# Altium project JDR2812-宇航（公开）.PrjPcb
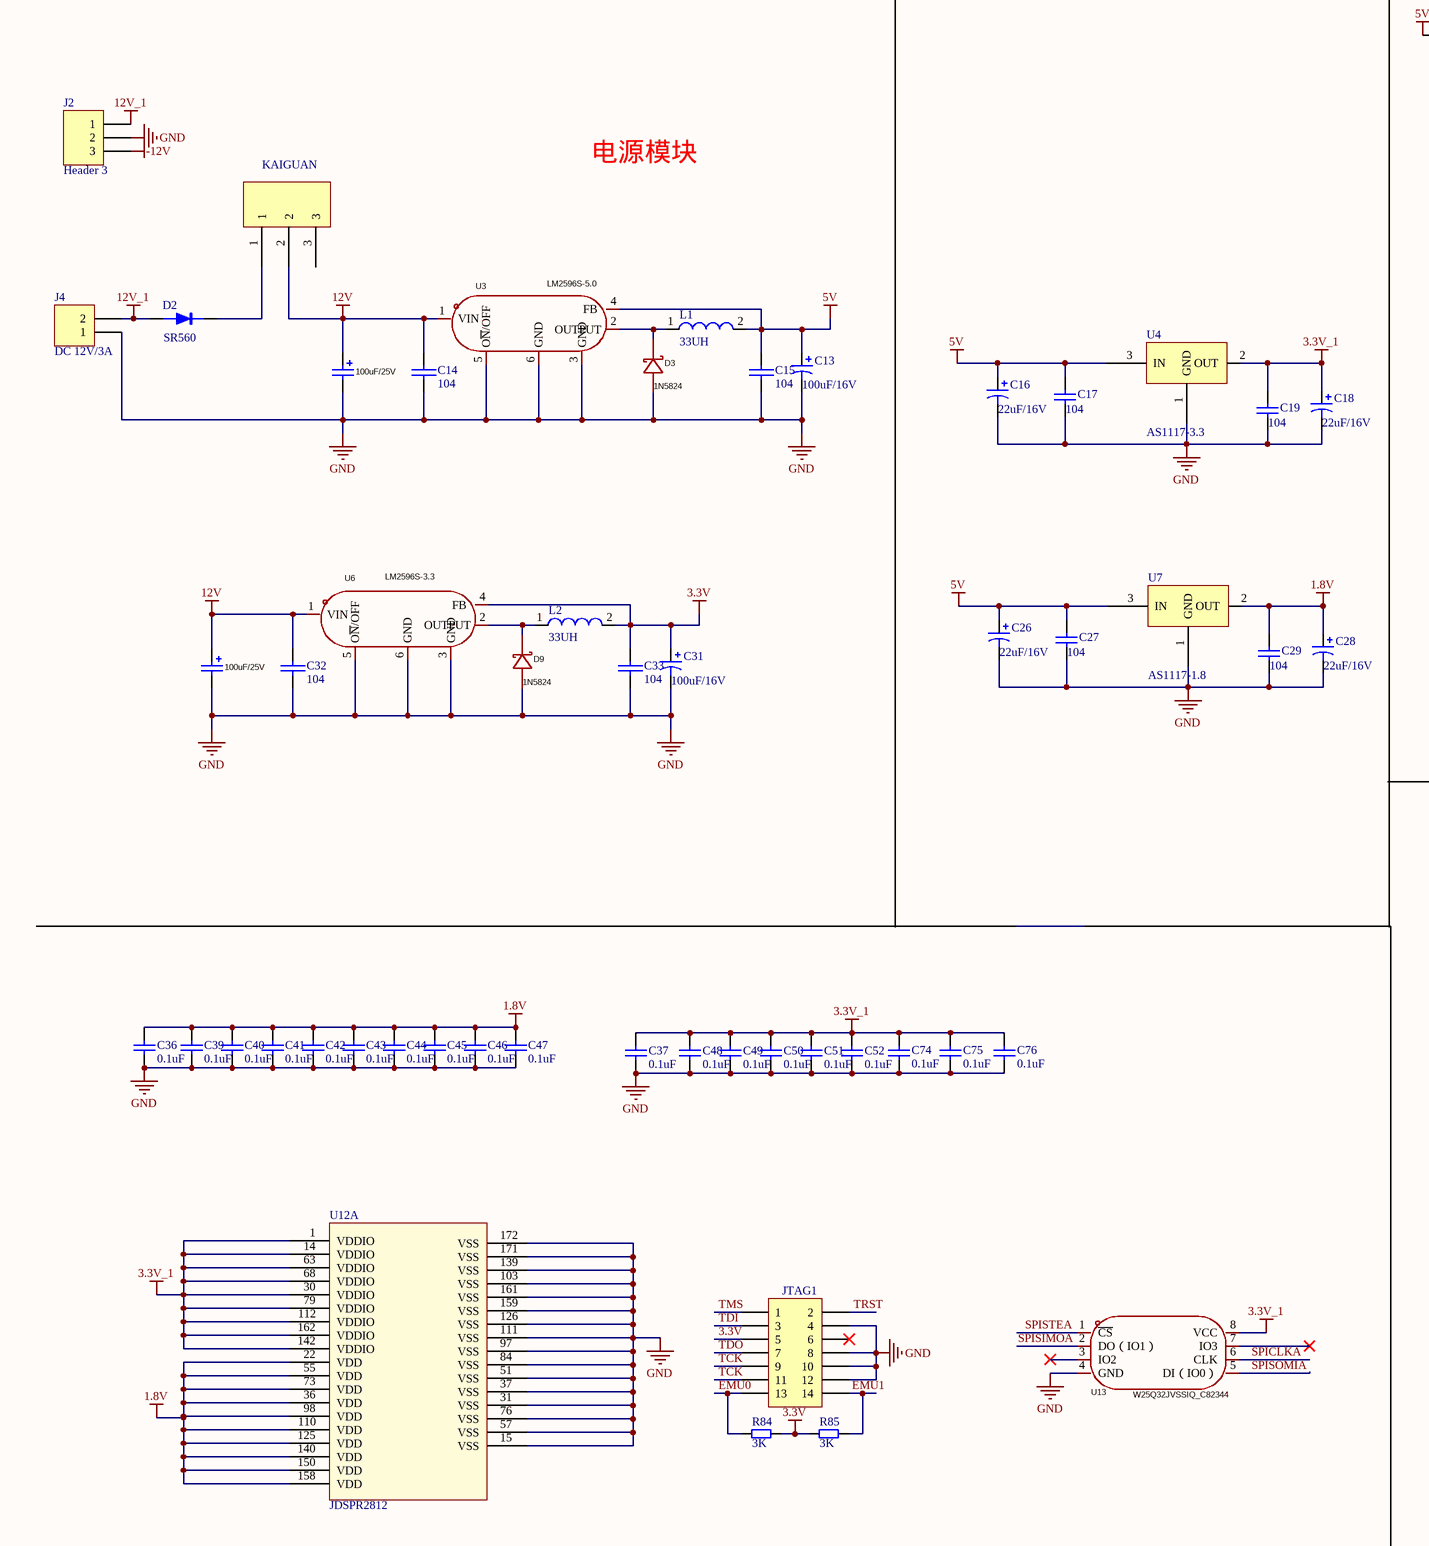
[diagram p0: JDR2812（公开）.SchDoc, top left]
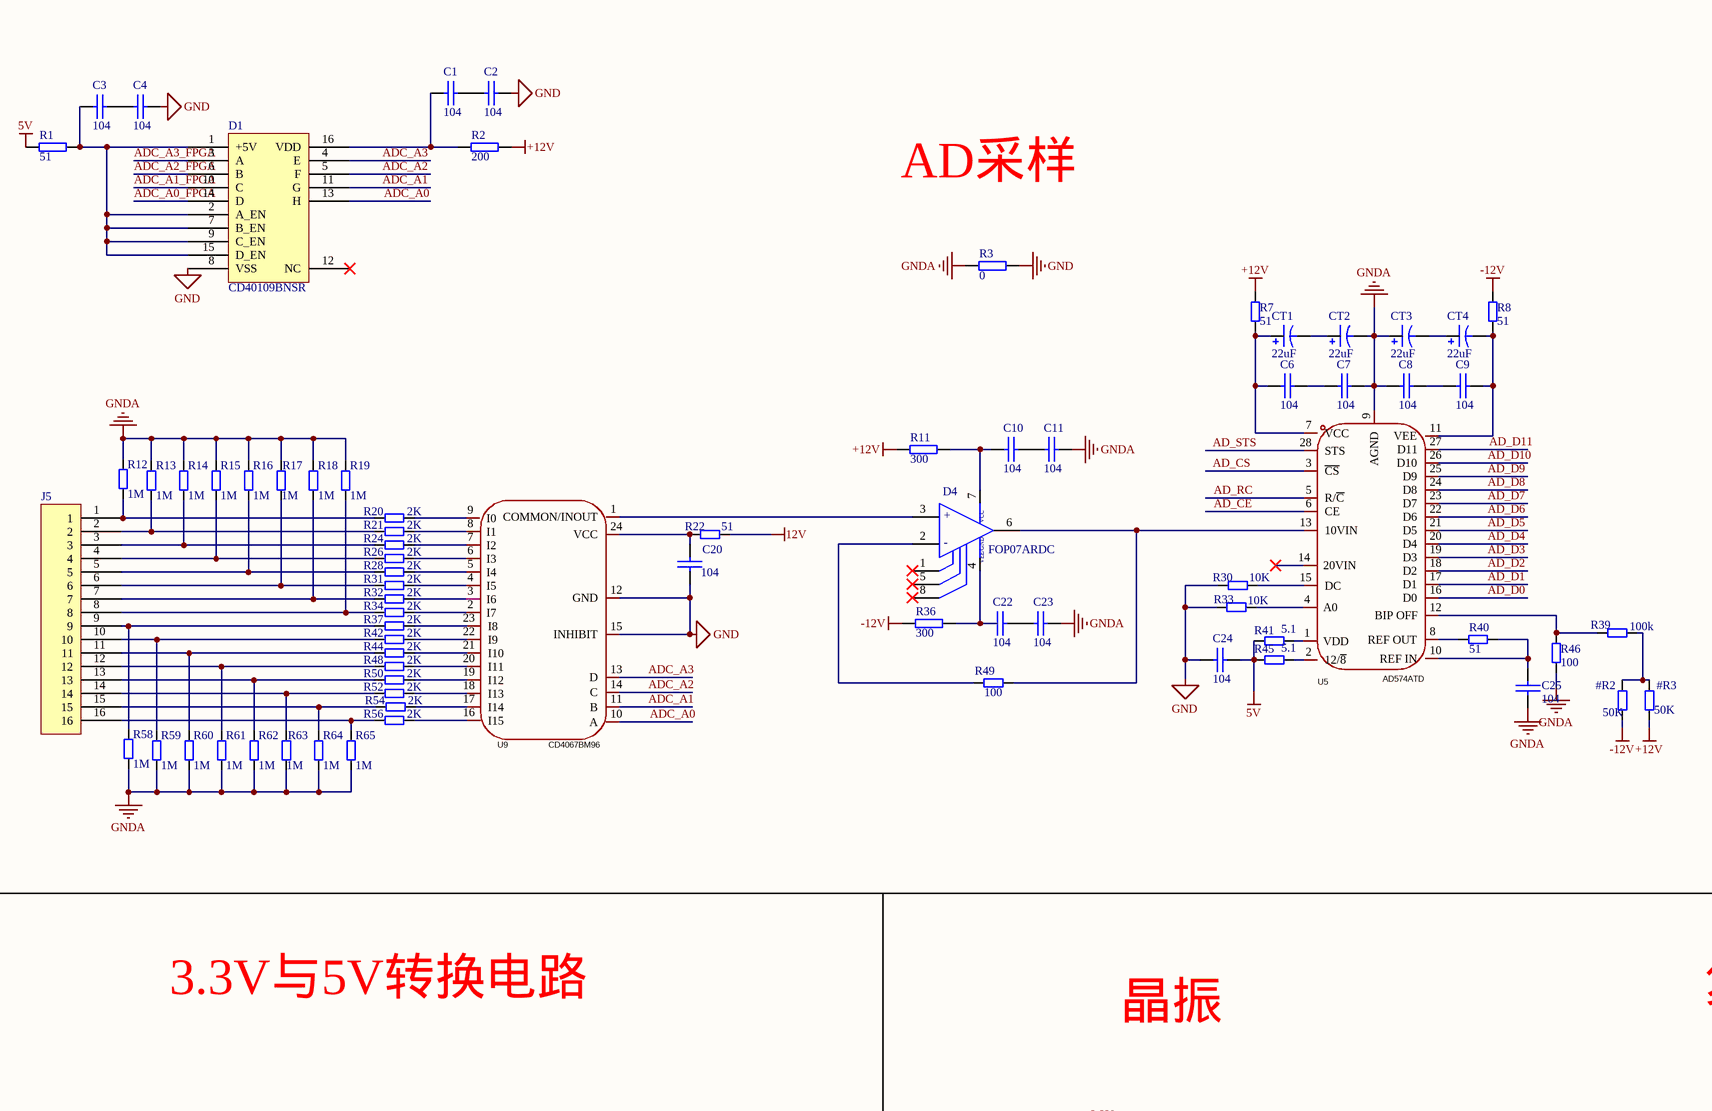
[diagram p1: JDR2812（公开）.SchDoc, top middle]
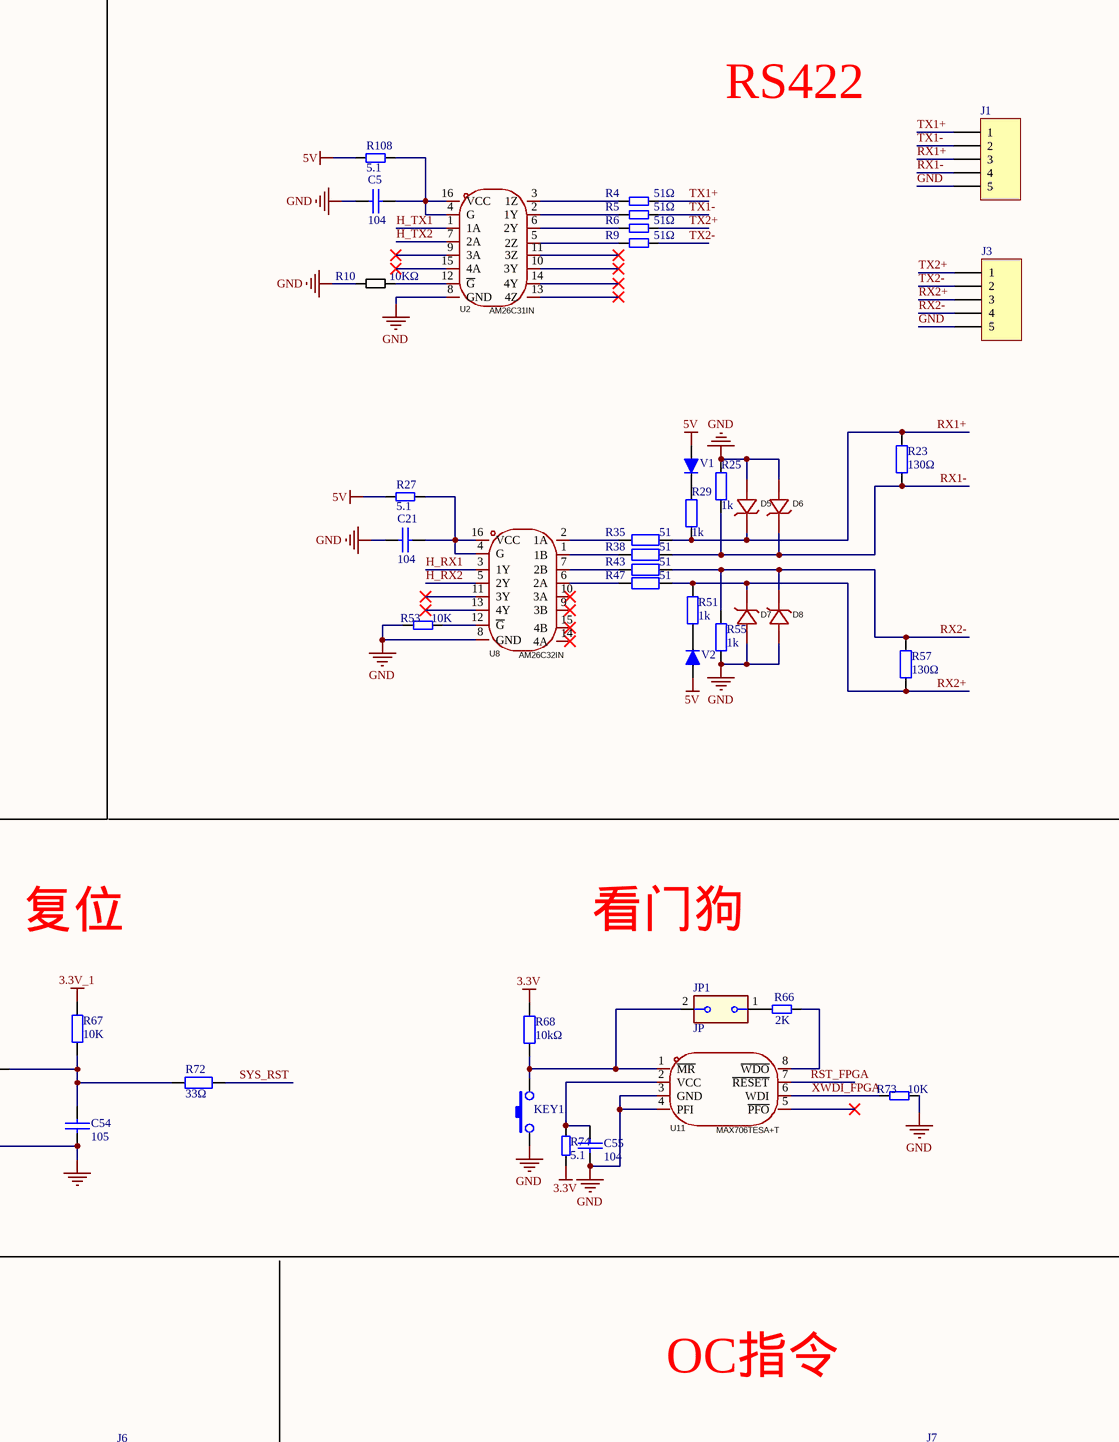
[diagram p2: JDR2812（公开）.SchDoc, top right]
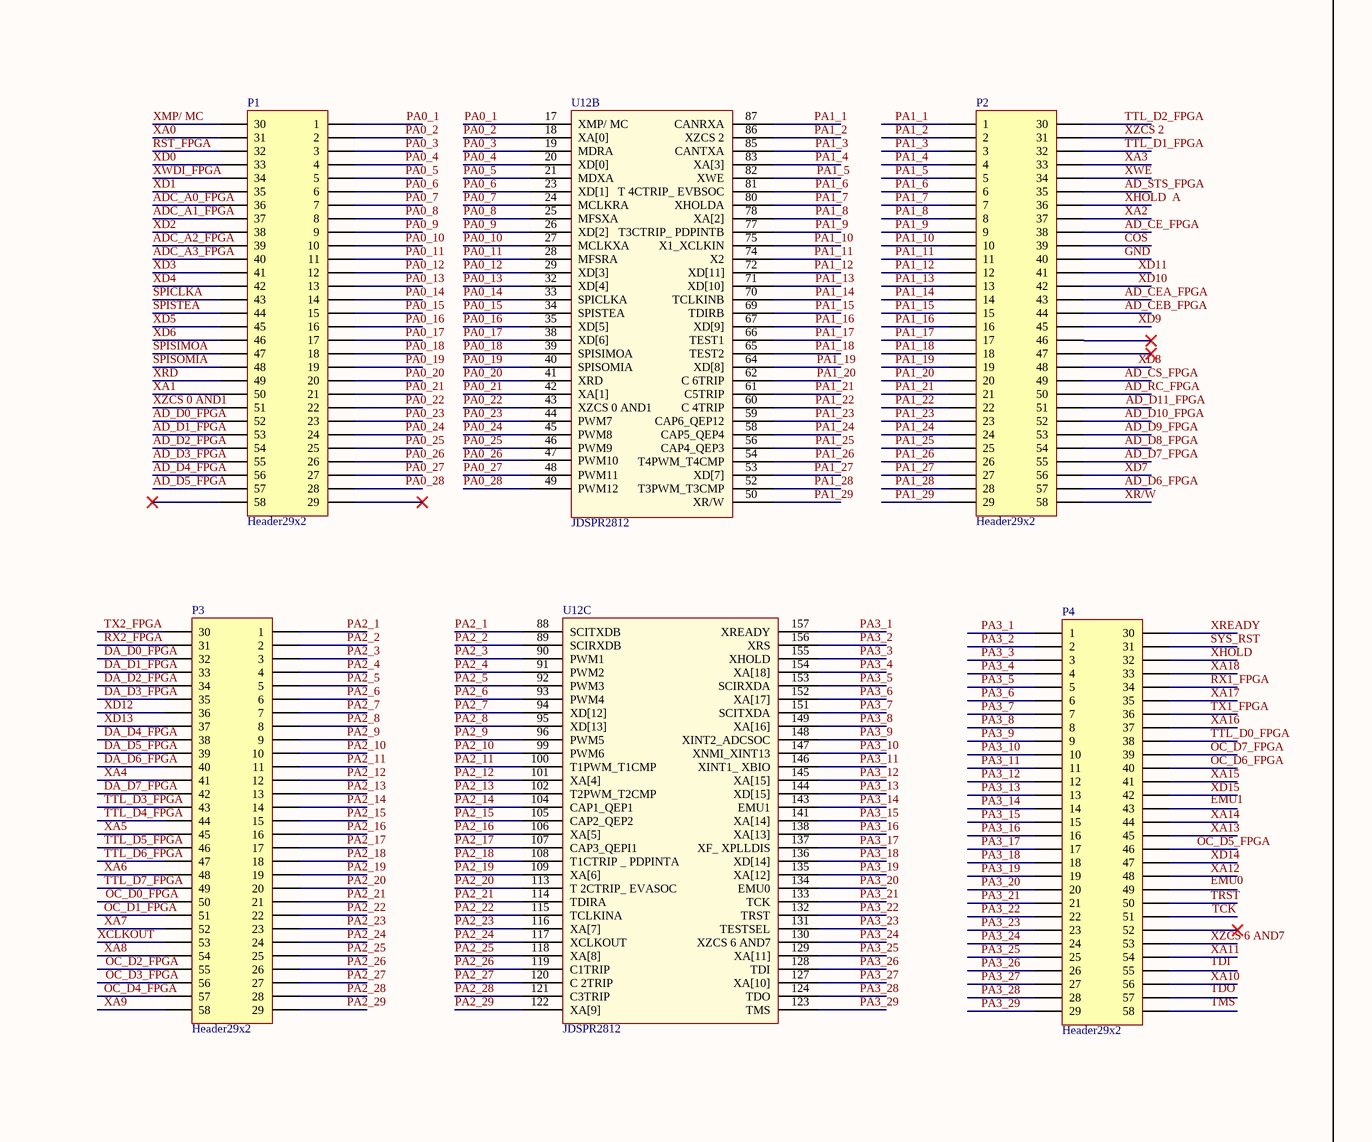
[diagram p3: JDR2812（公开）.SchDoc, bottom left]
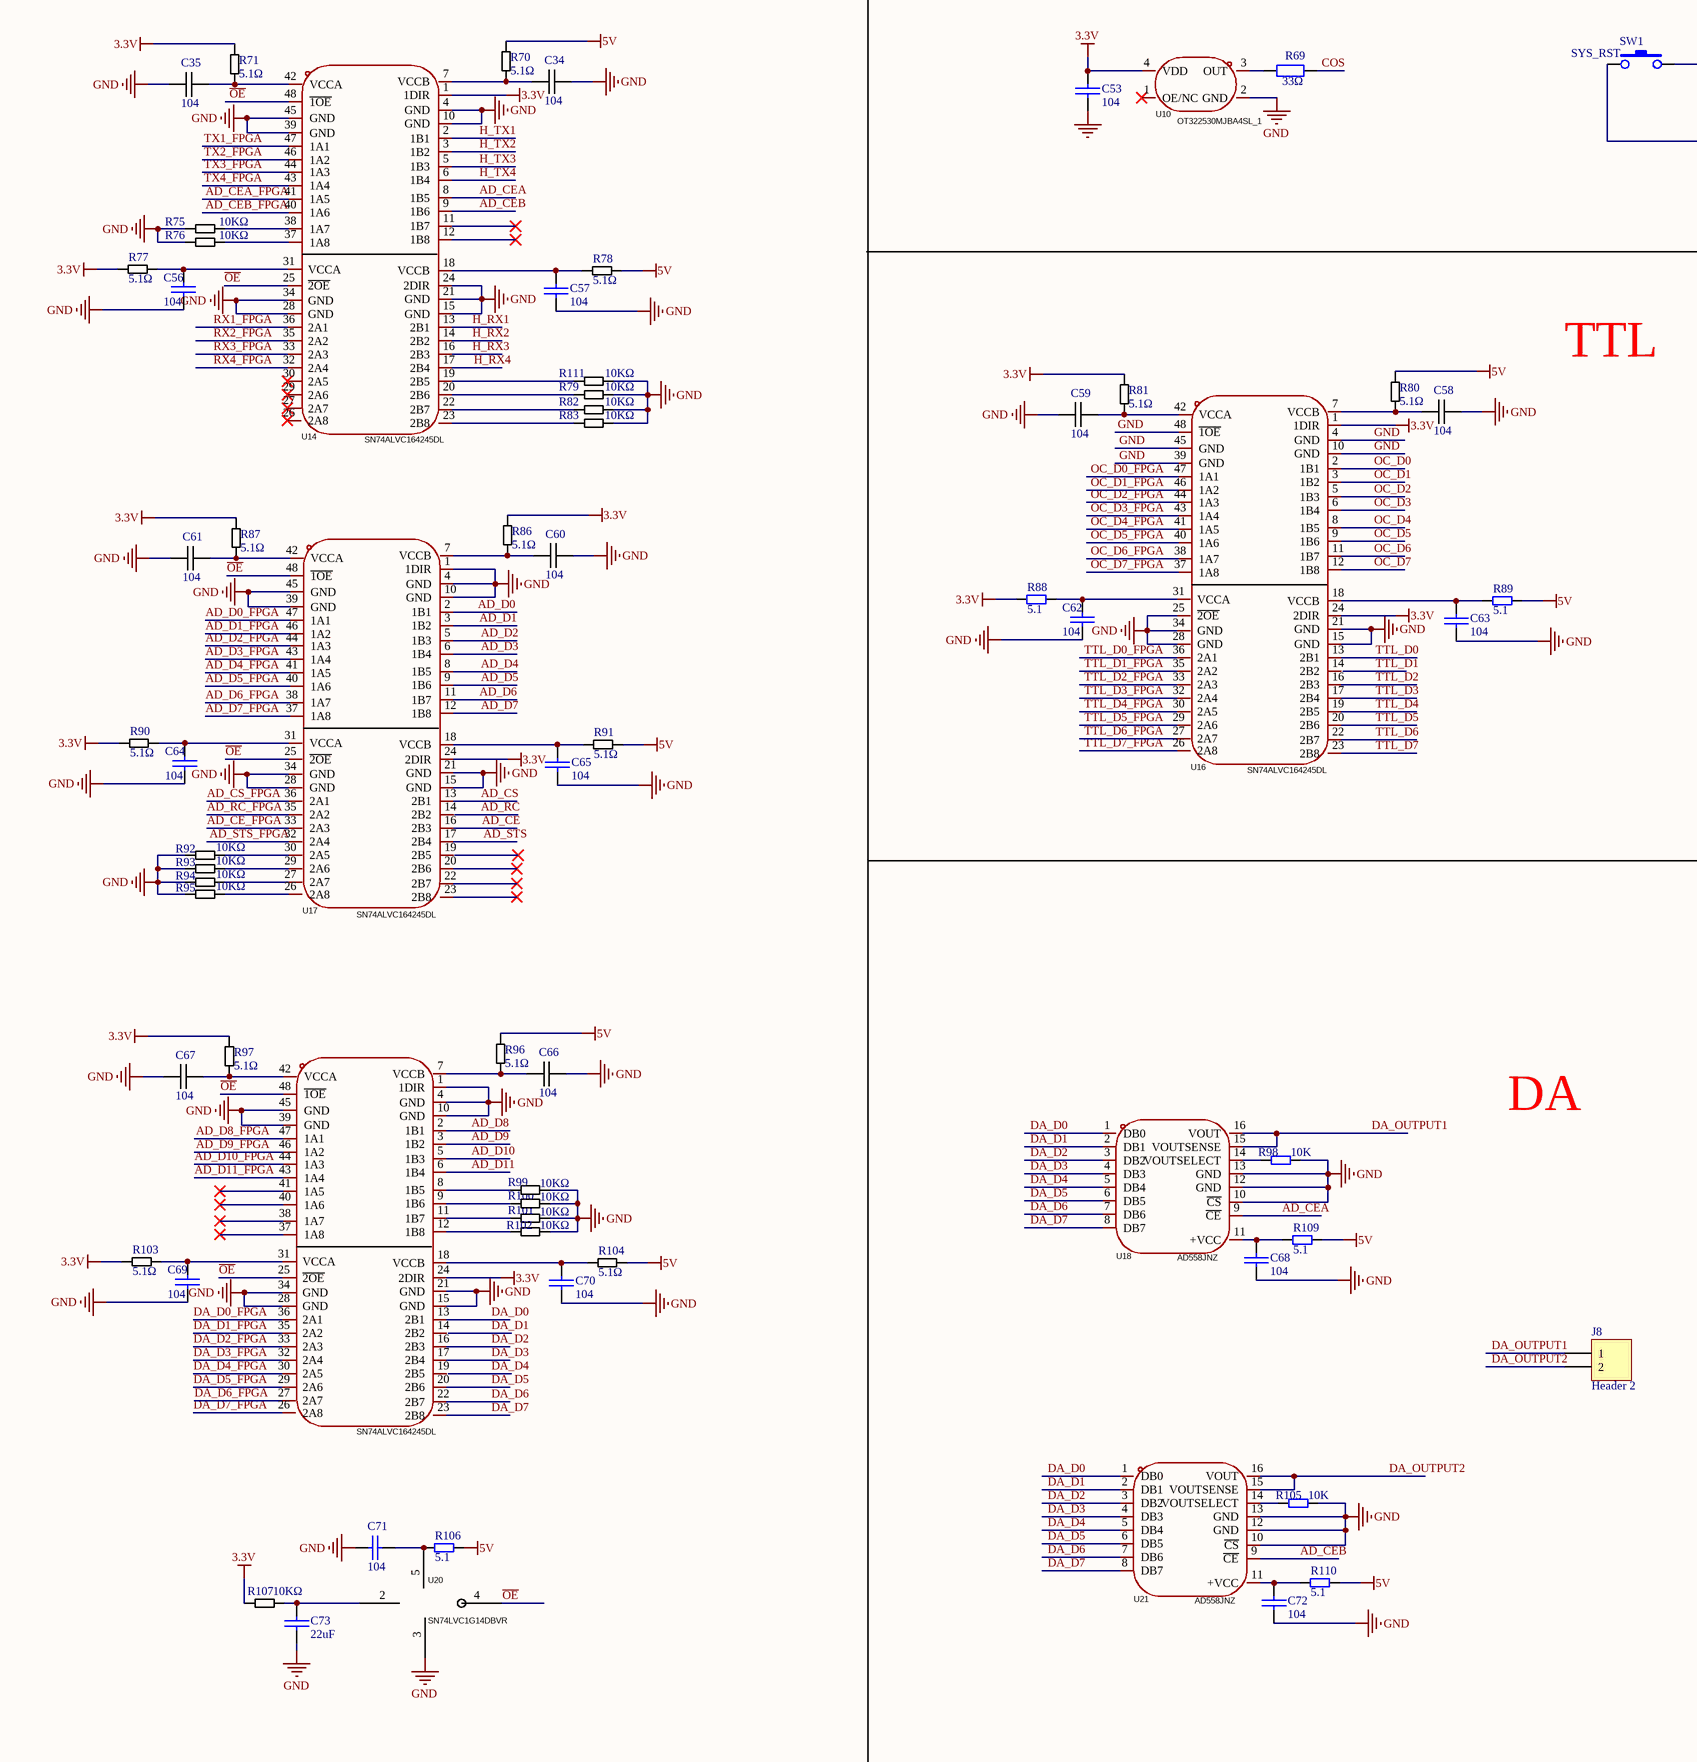
[diagram p4: JDR2812（公开）.SchDoc, bottom middle]
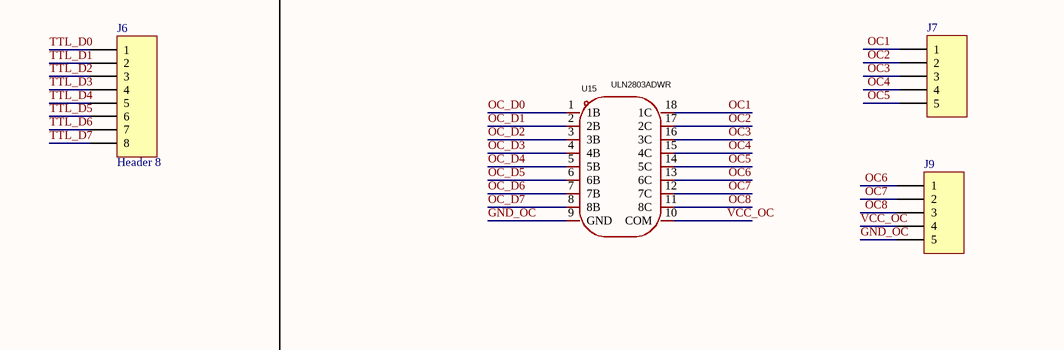
[diagram p5: JDR2812（公开）.SchDoc, bottom right]
1 sheet, 243 parts. Net scope: global (net labels, ports and power ports of the same name join across sheets).
Board file: JDR2812（公开）.PcbDoc

## Sheet JDR2812（公开）.SchDoc
size A1

### Parts
#R2  50K  [R0805]
#R3  50K  [R0805]
?  SN74ALVC164245DL  [CFP48]
C1  104  [C0805]
C2  104  [C0805]
C3  104  [C0805]
C4  104  [C0805]
C5  104  [C0805]
C6  104  [C0805]
C7  104  [C0805]
C8  104  [C0805]
C9  104  [C0805]
C10  104  [C0805]
C11  104  [C0805]
C12  value 100uF/25V  [钽电容 E壳(7342H)]  (hidden comment: 钽电容E型100uF/25V)
C13  value 100uF/16V  [钽电容 D壳(7343)]  (hidden comment: 钽电容D型100uF/16V)
C14  104  [C0805]
C15  104  [C0805]
C16  value 22uF/16V  [钽电容 B壳(3528)]  (hidden comment: 钽电容B型22uF/16V)
C17  104  [C0805]
C18  value 22uF/16V  [钽电容 B壳(3528)]  (hidden comment: 钽电容B型22uF/16V)
C19  104  [C0805]
C20  104  [C0805]
C21  104  [C0805]
C22  104  [C0805]
C23  104  [C0805]
C24  104  [C0805]
C25  104  [C0805]
C26  value 22uF/16V  [钽电容 B壳(3528)]  (hidden comment: 钽电容B型22uF/16V)
C27  104  [C0805]
C28  value 22uF/16V  [钽电容 B壳(3528)]  (hidden comment: 钽电容B型22uF/16V)
C29  104  [C0805]
C30  value 100uF/25V  [钽电容 E壳(7342H)]  (hidden comment: 钽电容E型100uF/25V)
C31  value 100uF/16V  [钽电容 D壳(7343)]  (hidden comment: 钽电容D型100uF/16V)
C32  104  [C0805]
C33  104  [C0805]
C34  104  [C0805]
C35  104  [C0805]
C36  0.1uF  [C0805]
C37  0.1uF  [C0805]
C39  0.1uF  [C0805]
C40  0.1uF  [C0805]
C41  0.1uF  [C0805]
C42  0.1uF  [C0805]
C43  0.1uF  [C0805]
C44  0.1uF  [C0805]
C45  0.1uF  [C0805]
C46  0.1uF  [C0805]
C47  0.1uF  [C0805]
C48  0.1uF  [C0805]
C49  0.1uF  [C0805]
C50  0.1uF  [C0805]
C51  0.1uF  [C0805]
C52  0.1uF  [C0805]
C53  104  [C0805]
C54  105  [C0805]
C55  104  [C0805]
C56  104  [C0805]
C57  104  [C0805]
C58  104  [C0805]
C59  104  [C0805]
C60  104  [C0805]
C61  104  [C0805]
C62  104  [C0805]
C63  104  [C0805]
C64  104  [C0805]
C65  104  [C0805]
C66  104  [C0805]
C67  104  [C0805]
C68  104  [C0805]
C69  104  [C0805]
C70  104  [C0805]
C71  104  [C0805]
C72  104  [C0805]
C73  22uF  [C0805]
C74  0.1uF  [C0805]
C75  0.1uF  [C0805]
C76  0.1uF  [C0805]
CT1  22uF  [钽电容 C壳(6032)]
CT2  22uF  [钽电容 C壳(6032)]
CT3  22uF  [钽电容 C壳(6032)]
CT4  22uF  [钽电容 C壳(6032)]
D1  CD40109BNSR  [SOP16]
D2  SR560  [DO-201AD]
D3  1N5824  [SOD-323_L1.7-W1.3-LS2.5-FD]
D4  FOP07ARDC  [DIP8]
D5  SMF5.0A  [SOD-123FL_L2.7-W1.8-LS3.8-RD]  (value not drawn)
D6  SMF5.0A_C908213  [SOD-123FL_L2.7-W1.8-LS3.8-RD]  (value not drawn)
D7  SMF5.0A  [SOD-123FL_L2.7-W1.8-LS3.8-RD]  (value not drawn)
D8  SMF5.0A  [SOD-123FL_L2.7-W1.8-LS3.8-RD]  (value not drawn)
D9  1N5824  [SOD-323_L1.7-W1.3-LS2.5-FD]
J1  Header 5  [KF2EDGK-2.54-WI-5P]  (value not drawn)
J2  Header 3  [HDR1X3]
J3  Header 5  [KF2EDGK-2.54-WI-5P]  (value not drawn)
J4  DC 12V/3A  [CDS-508H-2P]
J5  排针  [16PIN]  (value not drawn)
J6  Header 8  [header8]
J7  Header 5  [KF2EDGK-2.54-WI-5P]  (value not drawn)
J8  Header 2  [KF2EDGK-2.54-WI-2P]
J9  Header 5  [KF2EDGK-2.54-WI-5P]  (value not drawn)
JP1  JP  [2PIN-2.54]
JTAG1  Header 7X2  [HDR2X6]  (value not drawn)
KEY1  KEY  [TSW SMD-6*6*6]  (value not drawn)
L1  33UH  [SHC1004]
L2  33UH  [SHC1004]
P1  Header29x2  [29PIN X 2]
P2  Header29x2  [29PIN X 2]
P3  Header29x2  [29PIN X 2]
P4  Header29x2  [29PIN X 2]
R1  51  [R0805]
R2  200  [R0805]
R3  0  [R0805]
R4  51Ω  [R0805]
R5  51Ω  [R0805]
R6  51Ω  [R0805]
R7  51  [R0805]
R8  51  [R0805]
R9  51Ω  [R0805]
R10  10KΩ  [R0805]
R11  300  [R0805]
R12  1M  [R0805]
R13  1M  [R0805]
R14  1M  [R0805]
R15  1M  [R0805]
R16  1M  [R0805]
R17  1M  [R0805]
R18  1M  [R0805]
R19  1M  [R0805]
R20  2K  [R0805]
R21  2K  [R0805]
R22  51  [R0805]
R23  130Ω  [R0805]
R24  2K  [R0805]
R25  1k  [R0805]
R26  2K  [R0805]
R27  5.1  [R0805]
R28  2K  [R0805]
R29  1k  [R0805]
R30  10K  [R0805]
R31  2K  [R0805]
R32  2K  [R0805]
R33  10K  [R0805]
R34  2K  [R0805]
R35  51  [R0805]
R36  300  [R0805]
R37  2K  [R0805]
R38  51  [R0805]
R39  100k  [R0805]
R40  51  [R0805]
R41  5.1  [R0805]
R42  2K  [R0805]
R43  51  [R0805]
R44  2K  [R0805]
R45  5.1  [R0805]
R46  100  [R0805]
R47  51  [R0805]
R48  2K  [R0805]
R49  100  [R0805]
R50  2K  [R0805]
R51  1k  [R0805]
R52  2K  [R0805]
R53  10K  [R0805]
R54  2K  [R0805]
R55  1k  [R0805]
R56  2K  [R0805]
R57  130Ω  [R0805]
R58  1M  [R0805]
R59  1M  [R0805]
R60  1M  [R0805]
R61  1M  [R0805]
R62  1M  [R0805]
R63  1M  [R0805]
R64  1M  [R0805]
R65  1M  [R0805]
R66  2K  [R0805]
R67  10K  [R0805]
R68  10kΩ  [R0805]
R69  33Ω  [R0805]
R70  5.1Ω  [R0805]
R71  5.1Ω  [R0805]
R72  33Ω  [R0805]
R73  10K  [R0805]
R74  5.1  [R0805]
R75  10KΩ  [R0805]
R76  10KΩ  [R0805]
R77  5.1Ω  [R0805]
R78  5.1Ω  [R0805]
R79  10KΩ  [R0805]
R80  5.1Ω  [R0805]
R81  5.1Ω  [R0805]
R82  10KΩ  [R0805]
R83  10KΩ  [R0805]
R84  3K  [R0805]
R85  3K  [R0805]
R86  5.1Ω  [R0805]
R87  5.1Ω  [R0805]
R88  5.1  [R0805]
R89  5.1  [R0805]
R90  5.1Ω  [R0805]
R91  5.1Ω  [R0805]
R92  10KΩ  [R0805]
R93  10KΩ  [R0805]
R94  10KΩ  [R0805]
R95  10KΩ  [R0805]
R96  5.1Ω  [R0805]
R97  5.1Ω  [R0805]
R98  10K  [R0805]
R99  10KΩ  [R0805]
R100  10KΩ  [R0805]
R101  10KΩ  [R0805]
R102  10KΩ  [R0805]
R103  5.1Ω  [R0805]
R104  5.1Ω  [R0805]
R105  10K  [R0805]
R106  5.1  [R0805]
R107  10KΩ  [R0805]
R108  5.1  [R0805]
R109  5.1  [R0805]
R110  5.1  [R0805]
R111  10KΩ  [R0805]
SW1  SYS_RST  [TSW SMD-6*6*6]
U1  KAIGUAN  [KAIGUAN]
U2  AM26C31IN  [PDIP-16_L19.3-W6.4-P2.54-LS7.9-BL]
U3  LM2596S-5.0  [TO-263-5_L10.2-W8.6-P1.70-LS14.4-BR]
U4  AS1117-3.3  [SOT223]
U5  AD574ATD  [DIP28]
U6  LM2596S-3.3  [TO-263-5_L10.1-W8.7-P1.70-LS14.4-BR]
U7  AS1117-1.8  [SOT223]
U8  AM26C32IN  [PDIP-16_L19.3-W6.4-P2.54-LS7.9-BL]
U9  CD4067BM96  [SOIC-24_L15.4-W7.5-P1.27-LS10.3-BL]
U10  OT322530MJBA4SL_1  [OSC-SMD_4P-L3.2-W2.5-BL-1]
U11  MAX706TESA+T  [SOIC-8_L4.9-W3.9-P1.27-LS6.0-BL]
U12  JDSPR2812  [CQFP172]  (parts A,B,C of 3)
U13  W25Q32JVSSIQ_C82344  [SOIC-8_L5.3-W5.3-P1.27-LS8.0-BL]
U14  SN74ALVC164245DL  [CFP48]
U15  ULN2803ADWR  [SOIC-18_L11.6-W7.5-P1.27-LS10.3-BL]
U16  SN74ALVC164245DL  [CFP48]
U17  SN74ALVC164245DL  [CFP48]
U18  AD558JNZ  [PDIP-16_L22.1-W6.3-P2.54-LS7.6-BL]
U20  SN74LVC1G14DBVR  [SOT-23-5_L3.0-W1.7-P0.95-LS2.8-BR]
U21  AD558JNZ  [PDIP-16_L22.1-W6.3-P2.54-LS7.6-BL]
V1  LL4448  [2DK010]  (value not drawn)
V2  LL4448  [2DK010]  (value not drawn)

### Nets
1.8V: C28.1 C29.2 C36.1 C39.1 C40.2 C41.2 C42.2 C43.2 C44.2 C45.2 C46.2 C47.2 U7.2(OUT) U12.22(VDD) U12.36(VDD) U12.55(VDD) U12.73(VDD) U12.98(VDD) U12.110(VDD) U12.125(VDD) U12.140(VDD) U12.150(VDD) U12.158(VDD)
3.3V: ?.24(2DIR) C31.1 C33.1 C53.2 JTAG1.5 L2.2 R68.2 R71.1 R74.1 R77.2 R81.1 R84.2 R85.1 R86.1 R87.1 R88.1 R90.2 R97.1 R103.2 R107.1 U6.4(FB) U10.4(VDD) U14.1(1DIR) U16.1(1DIR) U16.24(2DIR) U17.24(2DIR)
3.3V_1: C18.1 C19.2 C37.2 C48.2 C49.2 C50.2 C51.1 C52.2 C74.2 C75.2 C76.2 R67.1 U4.2(OUT) U12.1(VDDIO) U12.14(VDDIO) U12.30(VDDIO) U12.63(VDDIO) U12.68(VDDIO) U12.79(VDDIO) U12.112(VDDIO) U12.142(VDDIO) U12.162(VDDIO) U13.8(VCC)
5V: C13.1 C15.1 C16.1 C17.2 C24.2 C26.1 C27.2 L1.2 R1.2 R27.2 R41.2 R45.2 R70.1 R78.2 R80.1 R89.1 R91.2 R96.1 R104.1 R106.1 R108.2 R109.1 R110.1 U3.4(FB) U4.3(IN) U7.3(IN) V1.1(A) V2.1(A)
12V: C12.1 C14.1 C30.1 C32.1 R22.1 U1.2 U3.1(VIN) U6.1(VIN)
12V_1: D2.1(A) J2.1 J4.2
+12V: #R3.2 R2.1 R7.2 R11.2
-12V: #R2.2 J2.3 R8.2 R36.2
GND: ?.1(1DIR) ?.4(GND) ?.10(GND) ?.15(GND) ?.21(GND) ?.28(GND) ?.34(GND) ?.39(GND) ?.45(GND) C2.1 C4.1 C5.1 C12.2 C13.2 C14.2 C15.2 C16.2 C17.1 C18.2 C19.1 C20.2 C21.1 C24.1 C26.2 C27.1 C28.2 C29.1 C30.2 C31.2 C32.2 C33.2 C34.1 C35.1 C36.2 C37.1 C39.2 C40.1 C41.1 C42.1 C43.1 C44.1 C45.1 C46.1 C47.1 C48.1 C49.1 C50.1 C51.2 C52.1 C53.1 C54.1 C55.2 C56.1 C57.1 C58.1 C59.1 C60.1 C61.1 C62.1 C63.1 C64.1 C65.1 C66.1 C67.1 C68.1 C69.1 C70.1 C71.1 C72.1 C73.1 C74.1 C75.1 C76.1 D1.8(VSS) D3.1(A) D5.2(A) D6.2(A) D7.2(A) D8.2(A) D9.1(A) J1.5 J2.2 J3.5 J4.1 JTAG1.4 JTAG1.8 JTAG1.10 JTAG1.12 KEY1.1 P2.40 R3.1 R10.2 R25.1 R30.2 R33.2 R53.2 R55.1 R73.1 R75.2 R76.2 R79.2 R82.2 R83.2 R92.2 R93.2 R94.2 R95.2 R98.1 R99.2 R100.2 R101.2 R102.2 R105.1 R111.2 SW1.1 U2.8(GND) U3.3(GND) U3.5(O~{N}/OFF) U3.6(GND) U4.1(GND) U6.3(GND) U6.5(O~{N}/OFF) U6.6(GND) U7.1(GND) U8.8(GND) U9.12(GND) U9.15(INHIBIT) U10.2(GND) U11.3(GND) U11.4(PFI) U12.15(VSS) U12.31(VSS) U12.37(VSS) U12.51(VSS) U12.57(VSS) U12.76(VSS) U12.84(VSS) U12.97(VSS) U12.103(VSS) U12.111(VSS) U12.126(VSS) U12.139(VSS) U12.159(VSS) U12.161(VSS) U12.171(VSS) U12.172(VSS) U13.4(GND) U14.4(GND) U14.10(GND) U14.15(GND) U14.21(GND) U14.24(2DIR) U14.28(GND) U14.34(GND) U14.39(GND) U14.45(GND) U16.4(GND) U16.10(GND) U16.15(GND) U16.21(GND) U16.25(~{2OE}) U16.28(GND) U16.34(GND) U16.39(GND) U16.45(GND) U16.48(~{1OE}) U17.1(1DIR) U17.4(GND) U17.10(GND) U17.15(GND) U17.21(GND) U17.28(GND) U17.34(GND) U17.39(GND) U17.45(GND) U18.10(~{CS}) U18.12(GND) U18.13(GND) U20.3(GND) U21.10(~{CS}) U21.12(GND) U21.13(GND)
GNDA: C7.1 C8.2 C11.2 C23.2 C25.2 CT2.2 CT3.1 R3.2 R12.2 R13.2 R14.2 R15.2 R16.2 R17.2 R18.2 R19.2 R46.2 R58.1 R59.1 R60.1 R61.1 R62.1 R63.1 R64.1 R65.1 U5.9(AGND)
~{OE}: ?.25(~{2OE}) ?.48(~{1OE}) U14.25(~{2OE}) U14.48(~{1OE}) U17.25(~{2OE}) U17.48(~{1OE}) U20.4
AD_CE: U5.6(CE) U17.16(2B3)
AD_CE_FPGA: P2.38 U17.33(2A3)
AD_CEA: U14.8(1B5) U18.9(~{CE})
AD_CEA_FPGA: P2.43 U14.41(1A5)
AD_CEB: U14.9(1B6) U21.9(~{CE})
AD_CEB_FPGA: P2.44 U14.40(1A6)
AD_CS: U5.3(~{CS}) U17.13(2B1)
AD_CS_FPGA: P2.49 U17.36(2A1)
AD_D0: U5.16(D0) U17.2(1B1)
AD_D0_FPGA: P1.52 U17.47(1A1)
AD_D1: U5.17(D1) U17.3(1B2)
AD_D1_FPGA: P1.53 U17.46(1A2)
AD_D2: U5.18(D2) U17.5(1B3)
AD_D2_FPGA: P1.54 U17.44(1A3)
AD_D3: U5.19(D3) U17.6(1B4)
AD_D3_FPGA: P1.55 U17.43(1A4)
AD_D4: U5.20(D4) U17.8(1B5)
AD_D4_FPGA: P1.56 U17.41(1A5)
AD_D5: U5.21(D5) U17.9(1B6)
AD_D5_FPGA: P1.57 U17.40(1A6)
AD_D6: U5.22(D6) U17.11(1B7)
AD_D6_FPGA: P2.57 U17.38(1A7)
AD_D7: U5.23(D7) U17.12(1B8)
AD_D7_FPGA: P2.55 U17.37(1A8)
AD_D8: ?.2(1B1) U5.24(D8)
AD_D8_FPGA: ?.47(1A1) P2.54
AD_D9: ?.3(1B2) U5.25(D9)
AD_D9_FPGA: ?.46(1A2) P2.53
AD_D10: ?.5(1B3) U5.26(D10)
AD_D10_FPGA: ?.44(1A3) P2.52
AD_D11: ?.6(1B4) U5.27(D11)
AD_D11_FPGA: ?.43(1A4) P2.51
AD_RC: U5.5(R/~{C})
AD_RC_FPGA: P2.50 U17.35(2A2)
AD_STS: U5.28(STS) U17.17(2B4)
AD_STS_FPGA: P2.35 U17.32(2A4)
ADC_A0: D1.13(H) U9.10(A)
ADC_A0_FPGA: D1.14(D) P1.36
ADC_A1: D1.11(G) U9.11(B)
ADC_A1_FPGA: D1.10(C) P1.37
ADC_A2: D1.5(F) U9.14(C)
ADC_A2_FPGA: D1.6(B) P1.39
ADC_A3: D1.4(E) U9.13(D)
ADC_A3_FPGA: D1.3(A) P1.40
COS: P2.39 R69.1
DA_D0: ?.13(2B1) U18.1(DB0) U21.1(DB0)
DA_D0_FPGA: ?.36(2A1) P3.32
DA_D1: U18.2(DB1) U21.2(DB1)
DA_D1_FPGA: ?.35(2A2) P3.33
DA_D2: ?.16(2B3) U18.3(DB2) U21.3(DB2)
DA_D2_FPGA: ?.33(2A3) P3.34
DA_D3: ?.17(2B4) U18.4(DB3) U21.4(DB3)
DA_D3_FPGA: ?.32(2A4) P3.35
DA_D4: U18.5(DB4) U21.5(DB4)
DA_D4_FPGA: ?.30(2A5) P3.38
DA_D5: ?.20(2B6) U18.6(DB5) U21.6(DB5)
DA_D5_FPGA: ?.29(2A6) P3.39
DA_D6: ?.22(2B7) U18.7(DB6) U21.7(DB6)
DA_D6_FPGA: ?.27(2A7) P3.40
DA_D7: ?.23(2B8) U18.8(DB7) U21.8(DB7)
DA_D7_FPGA: ?.26(2A8) P3.42
DA_OUTPUT1: J8.1 U18.15(VOUTSENSE) U18.16(VOUT)
DA_OUTPUT2: J8.2 U21.15(VOUTSENSE) U21.16(VOUT)
EMU0: JTAG1.13 R84.1
EMU1: JTAG1.14 R85.2
GND_OC: J9.5 U15.9(GND)
H_RX1: U8.3(1Y) U14.13(2B1)
H_RX2: U8.5(2Y) U14.14(2B2)
H_RX3: U14.16(2B3)
H_RX4: U14.17(2B4)
H_TX1: U2.1(1A) U14.2(1B1)
H_TX2: U2.7(2A) U14.3(1B2)
H_TX3: U14.5(1B3)
H_TX4: U14.6(1B4)
OC1: J7.1 U15.18(1C)
OC2: J7.2 U15.17(2C)
OC3: J7.3 U15.16(3C)
OC4: J7.4 U15.15(4C)
OC5: J7.5 U15.14(5C)
OC6: J9.1 U15.13(6C)
OC7: J9.2 U15.12(7C)
OC8: J9.3 U15.11(8C)
OC_D0: U15.1(1B) U16.2(1B1)
OC_D0_FPGA: P3.50 U16.47(1A1)
OC_D1: U15.2(2B) U16.3(1B2)
OC_D1_FPGA: P3.51 U16.46(1A2)
OC_D2: U15.3(3B) U16.5(1B3)
OC_D2_FPGA: P3.55 U16.44(1A3)
OC_D3: U15.4(4B) U16.6(1B4)
OC_D3_FPGA: P3.56 U16.43(1A4)
OC_D4: U15.5(5B) U16.8(1B5)
OC_D4_FPGA: P3.57 U16.41(1A5)
OC_D5: U15.6(6B) U16.9(1B6)
OC_D5_FPGA: P4.46 U16.40(1A6)
OC_D6: U15.7(7B) U16.11(1B7)
OC_D6_FPGA: P4.40 U16.38(1A7)
OC_D7: U15.8(8B) U16.12(1B8)
OC_D7_FPGA: P4.39 U16.37(1A8)
PA0_1: P1.1 U12.17(XMP/_MC)
PA0_2: P1.2 U12.18(XA[0])
PA0_3: P1.3 U12.19(MDRA)
PA0_4: P1.4 U12.20(XD[0])
PA0_5: P1.5 U12.21(MDXA)
PA0_6: P1.6 U12.23(XD[1])
PA0_7: P1.7 U12.24(MCLKRA)
PA0_8: P1.8 U12.25(MFSXA)
PA0_9: P1.9 U12.26(XD[2])
PA0_10: P1.10 U12.27(MCLKXA)
PA0_11: P1.11 U12.28(MFSRA)
PA0_12: P1.12 U12.29(XD[3])
PA0_13: P1.13 U12.32(XD[4])
PA0_14: P1.14 U12.33(SPICLKA)
PA0_15: P1.15 U12.34(SPISTEA)
PA0_16: P1.16 U12.35(XD[5])
PA0_17: P1.17 U12.38(XD[6])
PA0_18: P1.18 U12.39(SPISIMOA)
PA0_19: P1.19 U12.40(SPISOMIA)
PA0_20: P1.20 U12.41(XRD)
PA0_21: P1.21 U12.42(XA[1])
PA0_22: P1.22 U12.43(XZCS_0_AND1)
PA0_23: P1.23 U12.44(PWM7)
PA0_24: P1.24 U12.45(PWM8)
PA0_25: P1.25 U12.46(PWM9)
PA0_26: P1.26
PA0_27: P1.27 U12.48(PWM11)
PA0_28: P1.28 U12.49(PWM12)
PA1_1: P2.1 U12.87(CANRXA)
PA1_2: P2.2 U12.86(XZCS_2)
PA1_3: P2.3 U12.85(CANTXA)
PA1_4: P2.4 U12.83(XA[3])
PA1_5: P2.5 U12.82(XWE)
PA1_6: P2.6 U12.81(T_4CTRIP__EVBSOC)
PA1_7: P2.7 U12.80(XHOLDA)
PA1_8: P2.8 U12.78(XA[2])
PA1_9: P2.9 U12.77(T3CTRIP__PDPINTB)
PA1_10: P2.10 U12.75(X1_XCLKIN)
PA1_11: P2.11 U12.74(X2)
PA1_12: P2.12 U12.72(XD[11])
PA1_13: P2.13 U12.71(XD[10])
PA1_14: P2.14 U12.70(TCLKINB)
PA1_15: P2.15 U12.69(TDIRB)
PA1_16: P2.16 U12.67(XD[9])
PA1_17: P2.17 U12.66(TEST1)
PA1_18: P2.18 U12.65(TEST2)
PA1_19: P2.19 U12.64(XD[8])
PA1_20: P2.20 U12.62(C_6TRIP)
PA1_21: P2.21 U12.61(C5TRIP)
PA1_22: P2.22 U12.60(C_4TRIP)
PA1_23: P2.23 U12.59(CAP6_QEP12)
PA1_24: P2.24 U12.58(CAP5_QEP4)
PA1_25: P2.25 U12.56(CAP4_QEP3)
PA1_26: P2.26 U12.54(T4PWM_T4CMP)
PA1_27: P2.27 U12.53(XD[7])
PA1_28: P2.28 U12.52(T3PWM_T3CMP)
PA1_29: P2.29 U12.50(XR/W)
PA2_1: P3.1 U12.88(SCITXDB)
PA2_2: P3.2 U12.89(SCIRXDB)
PA2_3: P3.3 U12.90(PWM1)
PA2_4: P3.4 U12.91(PWM2)
PA2_5: P3.5 U12.92(PWM3)
PA2_6: P3.6 U12.93(PWM4)
PA2_7: P3.7 U12.94(XD[12])
PA2_8: P3.8 U12.95(XD[13])
PA2_9: P3.9 U12.96(PWM5)
PA2_10: P3.10 U12.99(PWM6)
PA2_11: P3.11 U12.100(T1PWM_T1CMP)
PA2_12: P3.12 U12.101(XA[4])
PA2_13: P3.13 U12.102(T2PWM_T2CMP)
PA2_14: P3.14 U12.104(CAP1_QEP1)
PA2_15: P3.15 U12.105(CAP2_QEP2)
PA2_16: P3.16 U12.106(XA[5])
PA2_17: P3.17 U12.107(CAP3_QEPI1)
PA2_18: P3.18 U12.108(T1CTRIP___PDPINTA)
PA2_19: P3.19 U12.109(XA[6])
PA2_20: P3.20 U12.113(T_2CTRIP__EVASOC)
PA2_21: P3.21 U12.114(TDIRA)
PA2_22: P3.22 U12.115(TCLKINA)
PA2_23: P3.23 U12.116(XA[7])
PA2_24: P3.24 U12.117(XCLKOUT)
PA2_25: P3.25 U12.118(XA[8])
PA2_26: P3.26 U12.119(C1TRIP)
PA2_27: P3.27 U12.120(C_2TRIP)
PA2_28: P3.28 U12.121(C3TRIP)
PA2_29: P3.29 U12.122(XA[9])
PA3_1: P4.1 U12.157(XREADY)
PA3_2: P4.2 U12.156(XRS)
PA3_3: P4.3 U12.155(XHOLD)
PA3_4: P4.4 U12.154(XA[18])
PA3_5: P4.5 U12.153(SCIRXDA)
PA3_6: P4.6 U12.152(XA[17])
PA3_7: P4.7 U12.151(SCITXDA)
PA3_8: P4.8 U12.149(XA[16])
PA3_9: P4.9 U12.148(XINT2_ADCSOC)
PA3_10: P4.10 U12.147(XNMI_XINT13)
PA3_11: P4.11 U12.146(XINT1__XBIO)
PA3_12: P4.12 U12.145(XA[15])
PA3_13: P4.13 U12.144(XD[15])
PA3_14: P4.14 U12.143(EMU1)
PA3_15: P4.15 U12.141(XA[14])
PA3_16: P4.16 U12.138(XA[13])
PA3_17: P4.17
PA3_18: P4.18 U12.136(XD[14])
PA3_19: P4.19 U12.135(XA[12])
PA3_20: P4.20 U12.134(EMU0)
PA3_21: P4.21 U12.133(TCK)
PA3_22: P4.22 U12.132(TRST)
PA3_23: P4.23 U12.131(TESTSEL)
PA3_24: P4.24 U12.130(XZCS_6_AND7)
PA3_25: P4.25 U12.129(XA[11])
PA3_26: P4.26 U12.128(TDI)
PA3_27: P4.27 U12.127(XA[10])
PA3_28: P4.28 U12.124(TDO)
PA3_29: P4.29 U12.123(TMS)
RST_FPGA: P1.32 U11.7(~{RESET})
RX1+: D5.1(C) J1.3 R23.1 R29.2 R35.1
RX1-: D6.1(C) J1.4 R23.2 R25.2 R38.1
RX1_FPGA: P4.34 U14.36(2A1)
RX2+: D7.1(C) J3.3 R47.1 R51.2 R57.2
RX2-: D8.1(C) J3.4 R43.1 R55.2 R57.1
RX2_FPGA: P3.31 U14.35(2A2)
RX3_FPGA: U14.33(2A3)
RX4_FPGA: U14.32(2A4)
SPICLKA: P1.43 U13.6(CLK)
SPISIMOA: P1.47 U13.2(DO（IO1）)
SPISOMIA: P1.48 U13.5(DI（IO0）)
SPISTEA: P1.44 U13.1(~{CS})
SYS_RST: P4.31 R72.1
TCK: JTAG1.9 JTAG1.11 P4.51
TDI: JTAG1.3
TDO: JTAG1.7
TMS: JTAG1.1
TRST: JTAG1.2 P4.50
TTL_D0: J6.1 U16.13(2B1)
TTL_D0_FPGA: P4.38 U16.36(2A1)
TTL_D1: J6.2
TTL_D1_FPGA: P2.32 U16.35(2A2)
TTL_D2: J6.3 U16.16(2B3)
TTL_D2_FPGA: P2.30 U16.33(2A3)
TTL_D3: J6.4 U16.17(2B4)
TTL_D3_FPGA: P3.43 U16.32(2A4)
TTL_D4: J6.5 U16.19(2B5)
TTL_D4_FPGA: P3.44 U16.30(2A5)
TTL_D5: J6.6 U16.20(2B6)
TTL_D5_FPGA: P3.46 U16.29(2A6)
TTL_D6: J6.7 U16.22(2B7)
TTL_D6_FPGA: P3.47 U16.27(2A7)
TTL_D7: J6.8 U16.23(2B8)
TTL_D7_FPGA: P3.49 U16.26(2A8)
TX1+: J1.1 R4.2
TX1-: J1.2 R5.2
TX1_FPGA: P4.36 U14.47(1A1)
TX2+: J3.1 R6.2
TX2-: J3.2 R9.2
TX2_FPGA: P3.30 U14.46(1A2)
TX3_FPGA: U14.44(1A3)
TX4_FPGA: U14.43(1A4)
VCC_OC: J9.4 U15.10(COM)
XA0: P1.31
XA1: P1.50
XA2: P2.37
XA3: P2.33
XA4: P3.41
XA5: P3.45
XA6: P3.48
XA7: P3.52
XA8: P3.54
XA9: P3.58
XA10: P4.56
XA11: P4.54
XA12: P4.48
XA13: P4.45
XA14: P4.44
XA15: P4.41
XA16: P4.37
XA17: P4.35
XA18: P4.33
XCLKOUT: P3.53
XD0: P1.33
XD1: P1.35
XD2: P1.38
XD3: P1.41
XD4: P1.42
XD5: P1.45
XD6: P1.46
XD7: P2.56
XD8: P2.48
XD9: P2.45
XD10: P2.42
XD11: P2.41
XD12: P3.36
XD13: P3.37
XD14: P4.47
XD15: P4.42
XHOLD: P4.32
XHOLD  A: P2.36
XMP/ MC: P1.30
XR/W: P2.58
XRD: P1.49
XREADY: P4.30
XWDI_FPGA: P1.34 R73.2 U11.6(WDI)
XWE: P2.34
XZCS 0 AND1: P1.51
XZCS 2: P2.31
XZCS 6 AND7: P4.53
Net#R2_1: #R2.1 #R3.1 R39.2
Net?_7: ?.7(VCCB) C66.2 R96.2
Net?_8: ?.8(1B5) R99.1
Net?_9: ?.9(1B6) R100.1
Net?_11: ?.11(1B7) R101.1
Net?_12: ?.12(1B8) R102.1
Net?_18: ?.18(VCCB) C70.2 R104.2
Net?_31: ?.31(VCCA) C69.2 R103.1
Net?_42: ?.42(VCCA) C67.2 R97.2
NetC1_1: C1.1 C2.2
NetC1_2: C1.2 D1.16(VDD) R2.2
NetC3_1: C3.1 C4.2
NetC3_2: C3.2 D1.1(+5V) D1.2(A_EN) D1.7(B_EN) D1.9(C_EN) D1.15(D_EN) R1.1
NetC5_2: C5.2 R108.1 U2.4(G) U2.16(VCC)
NetC6_1: C6.1 C7.2
NetC6_2: C6.2 CT1.1 R7.1 U5.7(VCC)
NetC8_1: C8.1 C9.2
NetC9_1: C9.1 CT4.2 R8.1 U5.11(VEE)
NetC10_1: C10.1 D4.7(V+) R11.1
NetC10_2: C10.2 C11.1
NetC20_1: C20.1 R22.2 U9.24(VCC)
NetC21_2: C21.2 R27.1 U8.4(G) U8.16(VCC)
NetC22_1: C22.1 D4.4(V-) R36.1
NetC22_2: C22.2 C23.1
NetC25_1: C25.1 R40.1 U5.10(REF_IN)
NetC34_2: C34.2 R70.2 U14.7(VCCB)
NetC35_2: C35.2 R71.2 U14.42(VCCA)
NetC54_2: C54.2 R67.2 R72.2 SW1.2
NetC55_1: C55.1 R74.2 U11.2(VCC)
NetC56_2: C56.2 R77.1 U14.31(VCCA)
NetC57_2: C57.2 R78.1 U14.18(VCCB)
NetC58_2: C58.2 R80.2 U16.7(VCCB)
NetC59_2: C59.2 R81.2 U16.42(VCCA)
NetC60_2: C60.2 R86.2 U17.7(VCCB)
NetC61_2: C61.2 R87.2 U17.42(VCCA)
NetC62_2: C62.2 R88.2 U16.31(VCCA)
NetC63_2: C63.2 R89.2 U16.18(VCCB)
NetC64_2: C64.2 R90.1 U17.31(VCCA)
NetC65_2: C65.2 R91.1 U17.18(VCCB)
NetC68_2: C68.2 R109.2 U18.11(+VCC)
NetC71_2: C71.2 R106.2 U20.5(VCC)
NetC72_2: C72.2 R110.2 U21.11(+VCC)
NetC73_2: C73.2 R107.2 U20.2(IN)
NetCT1_2: CT1.2 CT2.1
NetCT3_2: CT3.2 CT4.1
NetD2_2: D2.2(K) U1.1
NetD3_2: D3.2(K) L1.1 U3.2(OUTPUT)
NetD4_2: D4.2(IN-) R49.2
NetD4_3: D4.3(IN+) U9.1(COMMON/INOUT)
NetD4_6: D4.6(OUT) R49.1 U5.13(10VIN)
NetD9_2: D9.2(K) L2.1 U6.2(OUTPUT)
NetJ5_1: J5.1 R12.1 R20.1
NetJ5_2: J5.2 R13.1 R21.1
NetJ5_3: J5.3 R14.1 R24.1
NetJ5_4: J5.4 R15.1 R26.1
NetJ5_5: J5.5 R16.1 R28.1
NetJ5_6: J5.6 R17.1 R31.1
NetJ5_7: J5.7 R18.1 R32.1
NetJ5_8: J5.8 R19.1 R34.1
NetJ5_9: J5.9 R37.1 R58.2
NetJ5_10: J5.10 R42.1 R59.2
NetJ5_11: J5.11 R44.1 R60.2
NetJ5_12: J5.12 R48.1 R61.2
NetJ5_13: J5.13 R50.1 R62.2
NetJ5_14: J5.14 R52.1 R63.2
NetJ5_15: J5.15 R54.1 R64.2
NetJ5_16: J5.16 R56.1 R65.2
NetJP1_1: JP1.1 R66.2
NetJP1_2: JP1.2 KEY1.2 R68.1 U11.1(~{MR})
NetR4_1: R4.1 U2.3(1Z)
NetR5_1: R5.1 U2.2(1Y)
NetR6_1: R6.1 U2.6(2Y)
NetR9_1: R9.1 U2.5(2Z)
NetR10_1: R10.1 U2.12(~{G})
NetR20_2: R20.2 U9.9(I0)
NetR21_2: R21.2 U9.8(I1)
NetR24_2: R24.2 U9.7(I2)
NetR26_2: R26.2 U9.6(I3)
NetR28_2: R28.2 U9.5(I4)
NetR29_1: R29.1 V1.2(K)
NetR30_1: R30.1 U5.15(DC)
NetR31_2: R31.2 U9.4(I5)
NetR32_2: R32.2 U9.3(I6)
NetR33_1: R33.1 U5.4(A0)
NetR34_2: R34.2 U9.2(I7)
NetR35_2: R35.2 U8.2(1A)
NetR37_2: R37.2 U9.23(I8)
NetR38_2: R38.2 U8.1(1B)
NetR39_1: R39.1 R46.1 U5.12(BIP_OFF)
NetR40_2: R40.2 U5.8(REF_OUT)
NetR41_1: R41.1 U5.1(VDD)
NetR42_2: R42.2 U9.22(I9)
NetR43_2: R43.2 U8.7(2B)
NetR44_2: R44.2 U9.21(I10)
NetR45_1: R45.1 U5.2(12/~{8})
NetR47_2: R47.2 U8.6(2A)
NetR48_2: R48.2 U9.20(I11)
NetR50_2: R50.2 U9.19(I12)
NetR51_1: R51.1 V2.2(K)
NetR52_2: R52.2 U9.18(I13)
NetR53_1: R53.1 U8.12(~{G})
NetR54_2: R54.2 U9.17(I14)
NetR56_2: R56.2 U9.16(I15)
NetR66_1: R66.1 U11.8(~{WDO})
NetR69_2: R69.2 U10.3(OUT)
NetR75_1: R75.1 U14.38(1A7)
NetR76_1: R76.1 U14.37(1A8)
NetR79_1: R79.1 U14.20(2B6)
NetR82_1: R82.1 U14.22(2B7)
NetR83_1: R83.1 U14.23(2B8)
NetR92_1: R92.1 U17.30(2A5)
NetR93_1: R93.1 U17.29(2A6)
NetR94_1: R94.1 U17.27(2A7)
NetR95_1: R95.1 U17.26(2A8)
NetR98_2: R98.2 U18.14(VOUTSELECT)
NetR105_2: R105.2 U21.14(VOUTSELECT)
NetR111_1: R111.1 U14.19(2B5)

Not connected (* = marked no-connect by the designer): ? 14(2B2) 19(2B5) 37(1A8)* 38(1A7)* 40(1A6)* 41(1A5)*; D1 12(NC)*; D4 1(OA1)* 5(NC)* 8(OA2)*; JTAG1 6*; P1 29* 58*; P2 46 47*; P4 43 49 52* 55 57 58; U1 3; U2 9(3A)* 10(3Y)* 11(3Z)* 13(4Z)* 14(4Y)* 15(4A)*; U5 14(20VIN)*; U8 9(3B)* 10(3A)* 11(3Y)* 13(4Y)* 14(4A)* 15(4B)*; U10 1(OE/NC)*; U11 5(~{PFO})*; U12 47(PWM10) 137(XF__XPLLDIS); U13 3(IO2)* 7(IO3)*; U14 11(1B7)* 12(1B8)* 26(2A8)* 27(2A7)* 29(2A6)* 30(2A5)*; U16 14(2B2); U17 14(2B2) 19(2B5) 20(2B6)* 22(2B7)* 23(2B8)*

### Notes on the sheet
- AD采样
- RS422
- 电源模块
- 3.3V与5V转换电路
- 复位
- 看门狗
- 晶振
- TTL
- OC指令
- DA
- Labels drawn without touching a wire or pin: EMU0, EMU1, PA0_26, PA3_17, TDI, TDO, TMS
- (in symbol 7FOP07) +; VCC; -; VEE/GND

### Library data of the parts
#R2 #R3 = R0805: 1_器件名称: 片式电阻器; 2_型号规格: RM2012MBXXXFM; 3_质量等级: *; 5_生产厂家: *; 4_封装: R0805
? U14 U16 U17 = SN74ALVC164245DL: Manufacturer: TI(德州仪器); Add into BOM: yes; Channel Type: 双向; Supply Voltage (VCCA): 2.3V~3.6V; Supply Voltage (VCCB): 3V~5.5V; Number of Circuits: 2; Channels per Circuit: 8; Output Type: 非反相；三态; Symbol: SN74ALVC164245DL; Device: SN74ALVC164245DL; LCSC Part Name: SN74ALVC164245DL; Supplier Part: C354158; Manufacturer Part: SN74ALVC164245DL; Supplier Footprint: SSOP-48-300mil; JLCPCB Part Class: Extended Part; Datasheet: https://www.ti.com/cn/lit/gpn/sn74alvc164245; Supplier: LCSC; Convert to PCB: yes; Operating Temperature: -40℃~+85℃; Comment_1: SN74ALVC164245DL
C1-C4 C10 C11 C22 C23 = C0805: 1_器件名称: 瓷介片式电容器; 2_型号规格: CTK41L-0805-BY-100V-104K; 3_质量等级: *; 5_生产厂家: *; 4_封装: C0805
C5-C9 C20 C21 C24 C25 C34 C35 C53-C73 = CAP: Capacitor
C12 C30 = TAJE107M025RNJ: Manufacturer: Kyocera AVX; Add into BOM: yes; Tolerance: ±20%; Rated Voltage: 25V; Equivalent Series Resistance(ESR): 300mΩ@100kHz; Symbol: TAJE107M025RNJ; Device: TAJE107M025RNJ; LCSC Part Name: 100uF ±20% 25V; Supplier Part: C7230; Manufacturer Part: TAJE107M025RNJ; Supplier Footprint: CASE-E-7343-43(mm); JLCPCB Part Class: Extended Part; Datasheet: https://atta.szlcsc.com/upload/public/pdf/source/20160107/1457707750344.pdf; Supplier: LCSC; Convert to PCB: yes; Operating Temperature: -55℃~+125℃; Comment_1: 100uF/25V
C13 C16 C18 C26 C28 C31 = Cap Pol1: Polarized Capacitor (Radial); Published: 8-Jun-2000; LatestRevisionDate: 17-Jul-2002; LatestRevisionNote: Re-released for DXP Platform.; PackageReference: RB7.6-15; Publisher: Altium Limited
C14 C15 C32 C33 = CAP_1: Capacitor; 1_器件名称: 瓷介片式电容器; 2_型号规格: CT41L-0805-2C1-100V-104-K; 3_质量等级: J; 4_所属图号: Ru7.820.3508; 5_生产厂家: 715-6厂; value: 10nF
C17 C19 C27 C29 = Cap: Capacitor; Published: 8-Jun-2000; LatestRevisionDate: 17-Jul-2002; LatestRevisionNote: Re-released for DXP Platform.; PackageReference: RAD-0.3; Publisher: Altium Limited; Value: 104
C36 C37 C39-C52 C74-C76 = Cap: Capacitor; Value: 100pF; Published: 8-Jun-2000; LatestRevisionDate: 17-Jul-2002; LatestRevisionNote: Re-released for DXP Platform.; Publisher: Altium Limited
CT1 = 钽电容C壳: 1_器件名称: 片式钽电解质电容器; 2_型号规格: CA45-C025K226T; 3_质量等级: *; 4_封装: 钽电容C壳; 5_生产厂家: *
CT2-CT4 = 钽电容C壳: 1_器件名称: 片式钽电解质电容器; 2_型号规格: CAK45-C-25V-22uF-K; 3_质量等级: *; 4_封装: 钽电容C壳; 5_生产厂家: *
D1 = CC40109: 2_型号规格: JC40109R; 5_生产厂家: 北京宇翔; 1_器件名称: 四低高电平转换器; 4_封装: DIP16; 3_质量等级: *
D2 = DIODE
D3 D9 = B5819WS_C7420331: Manufacturer: 宏迦橙; Add into BOM: yes; Diode Configuration: 独立式; Forward Voltage (Vf@If): 600mV@1.0A; Reverse Voltage (Vr): 40V; Average Rectified Current (Io): 1A; Reverse Leakage Current (Ir): 1mA@40V; Peak forward surge current: 10A; Symbol: B5819WS_C7420331; Device: B5819WS_C7420331; LCSC Part Name: 电压:40V 电流:1A; Supplier Part: C7420331; Manufacturer Part: B5819WS; Supplier Footprint: SOD-323; JLCPCB Part Class: Extended Part; Datasheet: https://atta.szlcsc.com/upload/public/pdf/source/20230828/03CA0F4F90DAE368A7153B7B5E4D0651.pdf; Supplier: LCSC; Convert to PCB: yes; Comment_1: B5819WS
D4 = 7FOP07: 1_器件名称: 运放; 5_生产厂家: 771厂; 2_型号规格: OP07ARDC; 3_质量等级: *; 4_封装: DIP8
D5-D8 = SMF5.0A_C908213: Manufacturer: FUXINSEMI(富芯森美); Add into BOM: yes; Reverse Stand-Off Voltage (Vrwm): 5V; Maximum Clamping Voltage: 9.2V; Peak Pulse Current (Ipp)@10/1000us: 21.7A; Breakdown Voltage: 6.4V; Reverse Leakage Current (Ir): 800uA; Type: TVS; Symbol: SMF5.0A_C908213; Device: SMF5.0A_C908213; LCSC Part Name: SMF5.0A; Supplier Part: C908213; Manufacturer Part: SMF5.0A; Supplier Footprint: SOD-123; JLCPCB Part Class: Extended Part; Datasheet: https://atta.szlcsc.com/upload/public/pdf/source/20201023/C908211_2B6F82B5D5E79B5CF282141215A9A141.pdf; Supplier: LCSC; Convert to PCB: yes; Comment_1: SMF5.0A
J1 J3 J7 J9 = Header 5: Header, 5-Pin; LatestRevisionDate: 17-Jul-2002; LatestRevisionNote: Re-released for DXP Platform.; Publisher: Altium Limited
J2 = Header 3: Header, 3-Pin; LatestRevisionDate: 17-Jul-2002; LatestRevisionNote: Re-released for DXP Platform.; Publisher: Altium Limited
J4 = Header 2: 接插件; LatestRevisionDate: 17-Jul-2002; LatestRevisionNote: Re-released for DXP Platform.; Publisher: Altium Limited
J5 = 单排针16_1
J6 = Header 8: Header, 5-Pin; LatestRevisionDate: 17-Jul-2002; LatestRevisionNote: Re-released for DXP Platform.; Publisher: Altium Limited
J8 = Header 2: Header, 2-Pin; LatestRevisionDate: 17-Jul-2002; LatestRevisionNote: Re-released for DXP Platform.; Publisher: Altium Limited
JTAG1 = Header 7X2: Header, 7-Pin, Dual row; Revision: 17-Jul-2002: Re-released for DXP Platform.; Publisher: Altium Limited
KEY1 SW1 = SW-PB
L1 L2 = INDUCTOR
R1 = R1206: 1_器件名称: 片式电阻器; 2_型号规格: RM3216MB510FM; 3_质量等级: *; 5_生产厂家: *; 4_封装: R1206
R2 = R1206: 1_器件名称: 片式电阻器; 2_型号规格: RM3216MB201FM; 3_质量等级: *; 5_生产厂家: *; 4_封装: R1206
R3 = R1206: 1_器件名称: 片式电阻器; 2_型号规格: RM3216MB5R1FM; 3_质量等级: *; 5_生产厂家: *; 4_封装: R1206
R4-R9 R12-R22 R24 R26-R28 R30-R34 R37 R40-R42 R44-R46 R48 R50 R52-R54 R56 R58-R66 R73 R74 R84 R85 R88 R89 R98 R105 R106 R108-R110 = R0805: 1_器件名称: 片式电阻器; 2_型号规格: RM2012MB510FM; 3_质量等级: *; 5_生产厂家: *; 4_封装: R0805
R10 R70 R71 R75-R83 R86 R87 R90-R97 R99-R104 R107 R111 = RMK3216: 电阻器; 1_器件名称: 片式电阻器; 2_型号规格: RM3216-0.25W-5.1Ω±1%; 3_质量等级: J; 4_所属图号: Ru7.820.3508; 5_生产厂家: 718厂
R11 R36 = R1206: 1_器件名称: 片式电阻器; 2_型号规格: RM3216MB301FM; 3_质量等级: *; 5_生产厂家: *; 4_封装: R1206
R23 R25 R29 R35 R38 R43 R47 R51 R55 R57 R67-R69 R72 = Res2: Resistor; Published: 8-Jun-2000; LatestRevisionDate: 17-Jul-2002; LatestRevisionNote: Re-released for DXP Platform.; PackageReference: AXIAL-0.4; Publisher: Altium Limited
  R67: Value: 10K
  R69 R72: Value: 33Ω
R39 = R0805: 1_器件名称: 片式电阻器; 2_型号规格: RM2012MB0FM; 3_质量等级: *; 5_生产厂家: *; 4_封装: R0805
R49 = R0805: 1_器件名称: 片式电阻器; 2_型号规格: RM2012MB101FM; 3_质量等级: *; 5_生产厂家: *; 4_封装: R0805
U2 = AM26C31IN: Manufacturer: TI(德州仪器); Add into BOM: yes; Supply Voltage: 4.5V~5.5V; Symbol: AM26C31IN; Device: AM26C31IN; LCSC Part Name: AM26C31IN; Supplier Part: C2859571; Manufacturer Part: AM26C31IN; Supplier Footprint: PDIP-16; JLCPCB Part Class: Extended Part; Datasheet: https://www.ti.com/cn/lit/gpn/am26c31; Supplier: LCSC; Convert to PCB: yes; Operating Temperature: -40℃~+85℃; Comment_1: AM26C31IN
U3 = LM2596S-5.0/NOPB: Manufacturer: TI(德州仪器); Add into BOM: yes; Function: 降压型; Output Type: 固定; Input Voltage: 4.5V~40V; Output Voltage: 5V; Output Current (Max): 3A; Switching Frequency: 150kHz; Synchronous Rectification: 否; Number of Outputs: 1; Topology: 降压式; Switch tube (built-in/external): 内置; Symbol: LM2596S-5.0/NOPB; Device: LM2596S-5.0/NOPB; LCSC Part Name: LM2596S-5.0/NOPB; Supplier Part: C116713; Manufacturer Part: LM2596S-5.0/NOPB; Supplier Footprint: TO-263-5; JLCPCB Part Class: Extended Part; Datasheet: https://www.ti.com/cn/lit/gpn/lm2596; Supplier: LCSC; Convert to PCB: yes; Operating Temperature: -40℃~+125℃@(TJ); Comment_1: LM2596S-5.0/NOPB
U4 = AMS1117-XX: 3.3V稳压
U5 = AD574ATD: Manufacturer: ADI(亚德诺); Symbol: AD574AJNZ; Add into BOM: yes; Interface: 并行; number of channels: 1; Supply Voltage: 11.4V~16.5V; resolution: 12位; Device: AD574AJNZ; LCSC Part Name: AD574AJNZ; Supplier Part: C650206; Manufacturer Part: AD574AJNZ; Supplier Footprint: PDIP-28; JLCPCB Part Class: Extended Part; Datasheet: https://atta.szlcsc.com/upload/public/pdf/source/20210701/D414F4257B4C2C4D5A1A94707AAC65B9.pdf; Supplier: LCSC; Convert to PCB: yes; Operating Temperature: 0℃~+70℃; Comment_1: AD574AJNZ
U6 = LM2596S-3.3/NOPB: Manufacturer: TI(德州仪器); Add into BOM: yes; Function: 降压型; Output Type: 固定; Input Voltage: 4.5V~40V; Output Voltage: 3.3V; Output Current (Max): 3A; Switching Frequency: 150kHz; Synchronous Rectification: 否; Number of Outputs: 1; Topology: 降压式; Switch tube (built-in/external): 内置; Symbol: LM2596S-3.3/NOPB; Device: LM2596S-3.3/NOPB; LCSC Part Name: LM2596S-3.3/NOPB; Supplier Part: C2871122; Manufacturer Part: LM2596S-3.3/NOPB; Supplier Footprint: TO-263-5; JLCPCB Part Class: Extended Part; Datasheet: https://www.ti.com/cn/lit/gpn/lm2596; Supplier: LCSC; Convert to PCB: yes; Operating Temperature: -40℃~+125℃@(TJ); Comment_1: LM2596S-3.3/NOPB
U7 = AMS1117-XX: 1.8V稳压
U8 = AM26C32IN: Manufacturer: TI(德州仪器); Add into BOM: yes; Types: 接收器; Supply Voltage: 4.5V~5.5V; Driver/receiver: 0/4; Symbol: AM26C32IN; Device: AM26C32IN; LCSC Part Name: AM26C32IN; Supplier Part: C1544607; Manufacturer Part: AM26C32IN; Supplier Footprint: PDIP-16; JLCPCB Part Class: Extended Part; Datasheet: https://www.ti.com/cn/lit/gpn/am26c32; Supplier: LCSC; Convert to PCB: yes; Operating Temperature: -40℃~+85℃; Comment_1: AM26C32IN
U9 = CD4067BM96: Manufacturer: TI(德州仪器); Add into BOM: yes; Number of Channels: 1; Supply Voltage: 3V~18V; On-State Resistance (Max): 240Ω; Symbol: CD4067BM96; Device: CD4067BM96; LCSC Part Name: CD4067BM96; Supplier Part: C6525; Manufacturer Part: CD4067BM96; Supplier Footprint: SOIC-24-300mil; JLCPCB Part Class: Extended Part; Datasheet: https://www.ti.com/cn/lit/gpn/cd4067b; Supplier: LCSC; Convert to PCB: yes; Comment_1: CD4067BM96
U10 = OT322530MJBA4SL_1: Manufacturer: YXC(扬兴晶振); Add into BOM: yes; Value: 30MHz; Supply Voltage: 1.8V~3.3V; Frequency Stability(Full temperature range): ±10ppm; Symbol: OT322530MJBA4SL; Device: OT322530MJBA4SL; LCSC Part Name: 30MHz ±10ppm 1.8V~3.3V YSO110TR; Supplier Part: C2831390; Manufacturer Part: OT322530MJBA4SL; Supplier Footprint: SMD3225-4P; JLCPCB Part Class: Extended Part; Datasheet: https://atta.szlcsc.com/upload/public/pdf/source/20210329/C669065_30B18CFE780D377BA4E84F6ED1951959.pdf; Supplier: LCSC; Convert to PCB: yes; Operating Temperature: -40℃~+85℃; Comment_1: 30MHz
U11 = MAX706TESA+T: Manufacturer: ADI(亚德诺)/MAXIM(美信); Add into BOM: yes; ChipType: 简单复位/加电复位; Output Type: 推挽; Reset Active Level: 低电平有效; Threshold Voltage: 3.08V; Number of Voltages Monitored: 1; Reset Timeout: 140ms; Symbol: max706tesa+t; Device: MAX706TESA+T; LCSC Part Name: 监视+3V电压、低成本、微处理器监控电路; Supplier Part: C143580; Manufacturer Part: MAX706TESA+T; Supplier Footprint: SOIC-8; JLCPCB Part Class: Extended Part; Datasheet: https://atta.szlcsc.com/upload/public/pdf/source/20180629/C192393_74229EDE73756E54B9F877AA97A0ADB9.pdf; Supplier: LCSC; Convert to PCB: yes; Operating Temperature: -40℃~+85℃@(TA); Comment_1: MAX706TESA+T
U13 = W25Q32JVSSIQ_C82344: Manufacturer: WINBOND(华邦); Add into BOM: yes; Interface Type: SPI; Memory Size: 32Mbit; Supply Voltage: 2.7V~3.6V; Page Programming Time (Tpp): 3ms; Symbol: W25Q32JVSSIQ; Device: W25Q32JVSSIQ_C82344; LCSC Part Name: W25Q32JVSSIQ; Supplier Part: C82344; Manufacturer Part: W25Q32JVSSIQ; Supplier Footprint: SOIC-8-208mil; JLCPCB Part Class: Extended Part; Datasheet: https://atta.szlcsc.com/upload/public/pdf/source/20160910/1473490310454.pdf; Supplier: LCSC; Convert to PCB: yes; Operating Temperature: -40℃~+85℃; Comment_1: W25Q32JVSSIQ
U15 = ULN2803ADWR: Manufacturer: TI(德州仪器); Add into BOM: yes; Symbol: uln2803adwr; Device: ULN2803ADWR; LCSC Part Name: 停产; Supplier Part: C9683; Manufacturer Part: ULN2803ADWR; Supplier Footprint: SOIC-18-300mil; JLCPCB Part Class: Extended Part; Datasheet: https://www.ti.com/cn/lit/gpn/uln2803a; Supplier: LCSC; Convert to PCB: yes; Comment_1: ULN2803ADWR
U18 U21 = AD558JNZ: Manufacturer: ADI(亚德诺); Add into BOM: yes; Interface: 并行; Output Type: 电压-缓冲; Supply Voltage: 4.5V~16.5V; Resolution: 8位; Integral nonlinearity: ±0.5LSB; Settling Time: 3us; Symbol: ad558jnz; Device: AD558JNZ; LCSC Part Name: 电压输出8位数模转换器，集成输出放大器、完全微处理器接口和精密基准电压源; Supplier Part: C55750; Manufacturer Part: AD558JNZ; Supplier Footprint: PDIP-16; JLCPCB Part Class: Extended Part; Datasheet: https://atta.szlcsc.com/upload/public/pdf/source/20150821/1457707347677.pdf; Supplier: LCSC; Convert to PCB: yes; Operating Temperature: 0℃~+70℃; Comment_1: AD558JNZ
U20 = SN74LVC1G14DBVR: Manufacturer: TI(德州仪器); Add into BOM: yes; Input Type: 施密特触发器; Supply Voltage(Single): 1.65V~5.5V; Supply Current (Max): 10uA; Number of Circuits: 1; Sink Current: 32mA; High level range (VIH): 1.16V~3.33V; Low level range (VIL): 390mV~1.87V; Max Propagation Delay: 6.5ns@2.5V,50pF; Symbol: SN74LVC1G14DBVR; Device: SN74LVC1G14DBVR; LCSC Part Name: 单路施密特触发反相器; Supplier Part: C7835; Manufacturer Part: SN74LVC1G14DBVR; Supplier Footprint: SOT-23-5; JLCPCB Part Class: Extended Part; Datasheet: https://www.ti.com/cn/lit/gpn/sn74lvc1g14; Supplier: LCSC; Convert to PCB: yes; Number of Inputs: 1; Source Current: 32mA; Series: 74LVC系列; Operating Temperature: -40℃~+125℃; Comment_1: SN74LVC1G14DBVR
V1 V2 = Diode 1N4007_1: 1 Amp General Purpose Rectifier; Published: 8-Jun-2000; LatestRevisionDate: 17-Jul-2002; LatestRevisionNote: Re-released for DXP Platform.; DatasheetVersion: 1998; PackageVersion: Aug-1999; PackageReference: DO-41; Publisher: Altium Limited; Code_JEDEC: DO-204-AL; ComponentLink1Description: Manufacturer Link; ComponentLink1URL: http://www.fairchildsemi.com/; ComponentLink2Description: Datasheet; ComponentLink2URL: http://www.fairchildsemi.com/ds/1N%2F1N4001.pdf